# EAGLE design M236X (EAGLE 6.6.0)
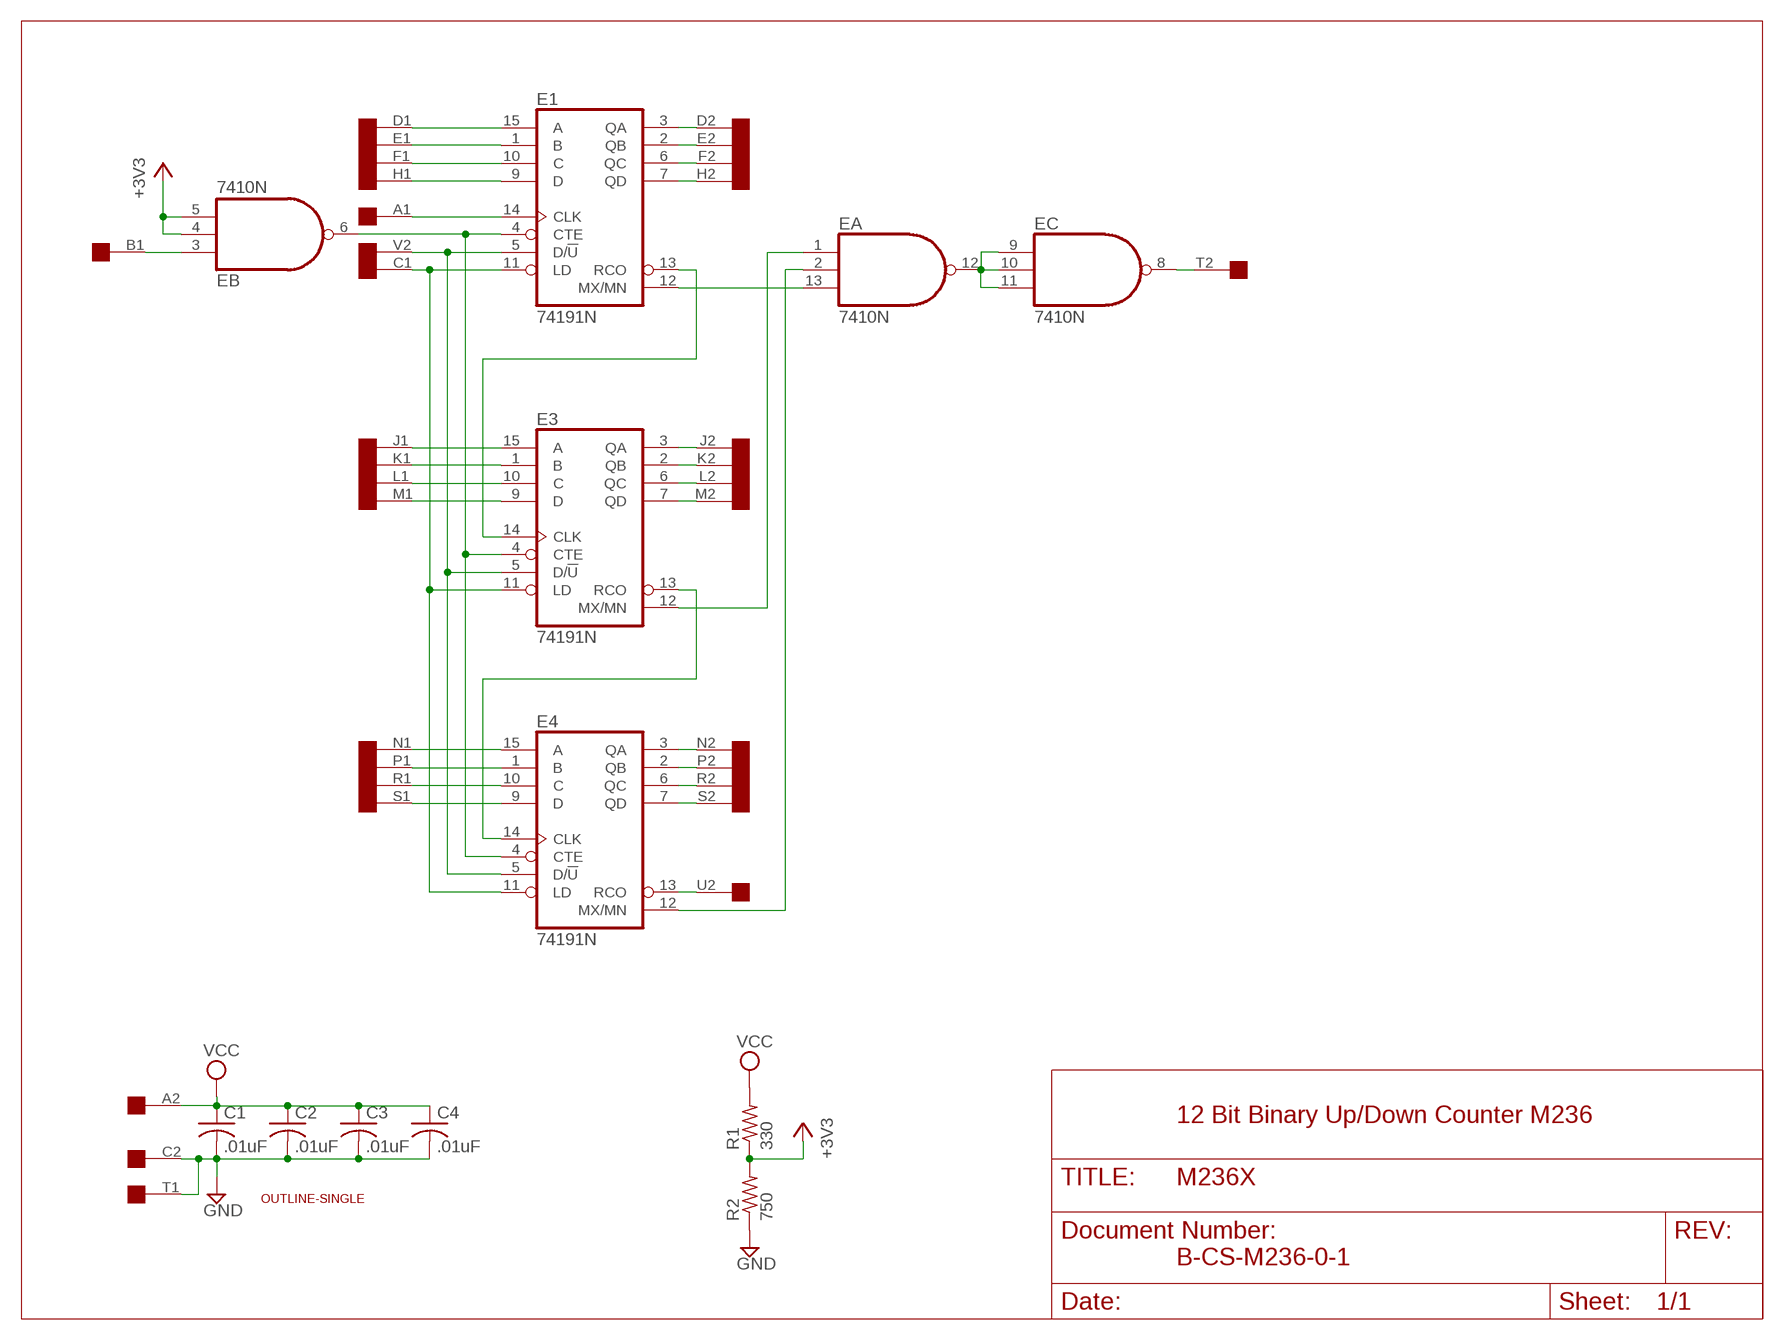
[diagram p0: schematic, sheet 1]

## Parts
C1  .01uF  C-US050-025X075  [C050-025X075]
C2  .01uF  C-US050-025X075  [C050-025X075]
C3  .01uF  C-US050-025X075  [C050-025X075]
C4  .01uF  C-US050-025X075  [C050-025X075]
E  7410N  [DIL14]
E1  74191N  [DIL16]
E3  74191N  [DIL16]
E4  74191N  [DIL16]
R1  330  R-US_0207/10  [0207/10]
R2  750  R-US_0207/10  [0207/10]
U$1  OUTLINE-SINGLE  [SINGLE]
U$2  SINGLE  [EDGE-CON2]

## Nets
+3V3: E.4(B:I1) E.5(B:I2) R1.1 R2.2
GND: C1.2 C2.2 C3.2 C4.2 R2.1 U$2.C2 U$2.T1
N$1: E1.7(QD) U$2.H2
N$2: E1.6(QC) U$2.F2
N$3: E1.2(QB) U$2.E2
N$4: E1.3(QA) U$2.D2
N$5: E1.9(D) U$2.H1
N$6: E1.10(C) U$2.F1
N$7: E1.1(B) U$2.E1
N$8: E1.15(A) U$2.D1
N$9: E3.6(QC) U$2.L2
N$10: E3.7(QD) U$2.M2
N$11: E4.3(QA) U$2.N2
N$12: E4.2(QB) U$2.P2
N$13: E4.6(QC) U$2.R2
N$14: E4.7(QD) U$2.S2
N$15: E3.2(QB) U$2.K2
N$16: E3.3(QA) U$2.J2
N$17: E4.9(D) U$2.S1
N$18: E4.10(C) U$2.R1
N$19: E4.1(B) U$2.P1
N$20: E4.15(A) U$2.N1
N$21: E3.9(D) U$2.M1
N$22: E3.10(C) U$2.L1
N$23: E3.1(B) U$2.K1
N$24: E3.15(A) U$2.J1
N$25: E1.11(LD) E3.11(LD) E4.11(LD) U$2.C1
N$26: E1.5(D/!U) E3.5(D/!U) E4.5(D/!U) U$2.V2
N$27: E4.13(RCO) U$2.U2
N$28: E.8(C:O) U$2.T2
N$29: E1.4(CTE) E3.4(CTE) E4.4(CTE) E.6(B:O)
N$30: E3.13(RCO) E4.14(CLK)
N$31: E.3(B:I0) U$2.B1
N$32: E4.12(MX/MN) E.2(A:I1)
N$33: E3.12(MX/MN) E.1(A:I0)
N$34: E.9(C:I0) E.10(C:I1) E.11(C:I2) E.12(A:O)
N$35: E1.12(MX/MN) E.13(A:I2)
N$36: E1.14(CLK) U$2.A1
N$37: E1.13(RCO) E3.14(CLK)
VCC: C1.1 C2.1 C3.1 C4.1 R1.2 U$2.A2
Unconnected: U$2.B2 U$2.U1 U$2.V1

## Notes on the sheet
- 12 Bit Binary Up/Down Counter M236
- B-CS-M236-0-1

## Power pins joined to a net without a drawn wire
GND: E1.8(GND) E3.8(GND) E4.8(GND) E.7(P:GND)
VCC: E1.16(VCC) E3.16(VCC) E4.16(VCC) E.14(P:VCC)

## Library data of the parts
C1-C4 = rcl:C-US: CAPACITOR, American symbol
E = 74xx-us:74*10: Triple 3-input NAND gate
E1 E3 E4 = 74xx-us:74*191: Synchronous UP/DOWN COUNTER
R1 R2 = rcl:R-US_: RESISTOR, American symbol
U$1 = dec-con:OUTLINE-*: Board outlines for DEC boards.
U$2 = dec-con:SINGLE: Single-Height DEC board

## Net classes
0 default: width 0.813 mm

## Board
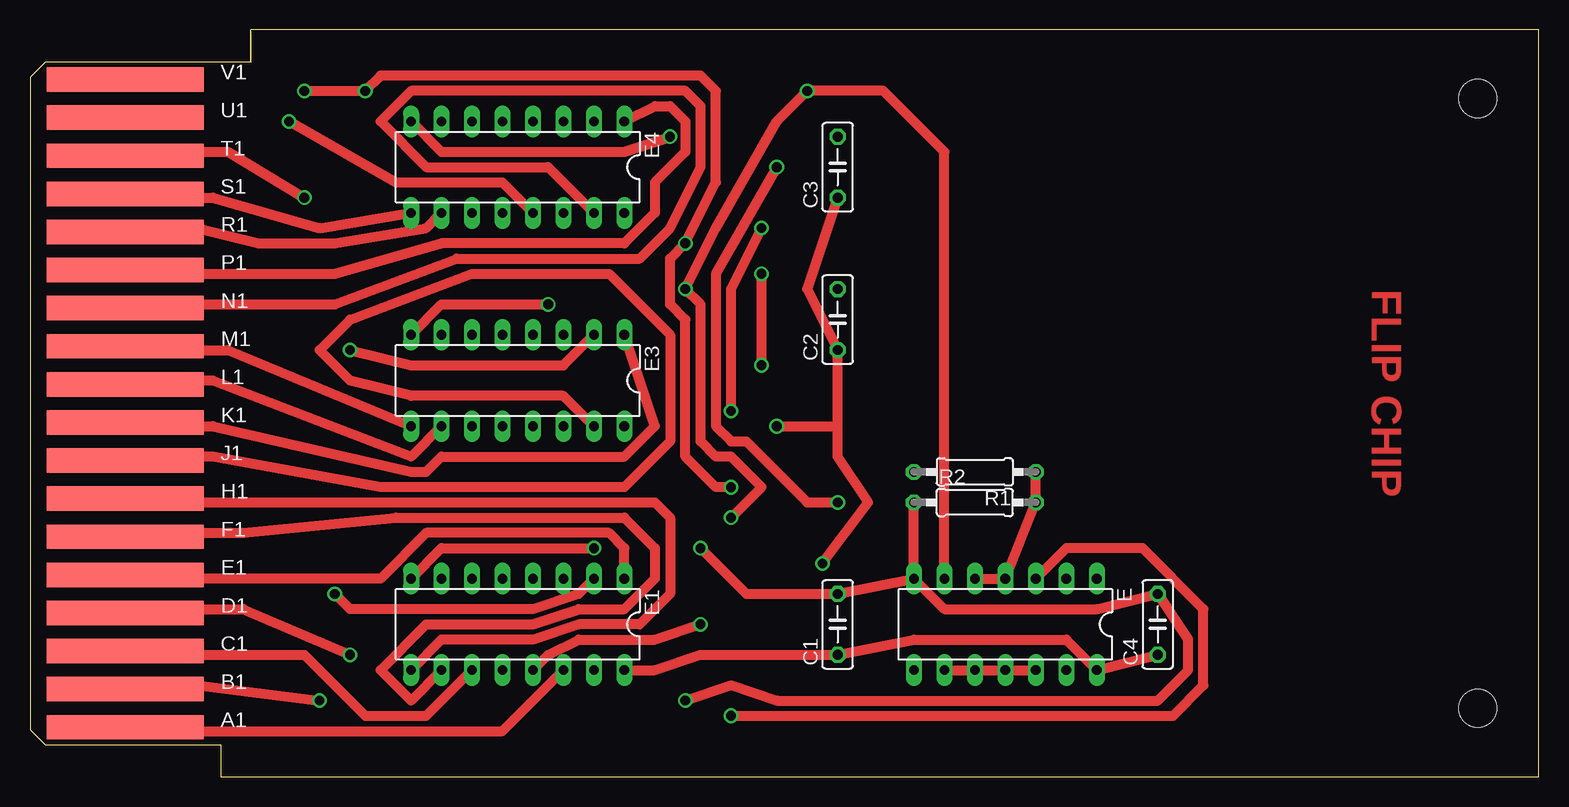
[diagram p1: board, top side]
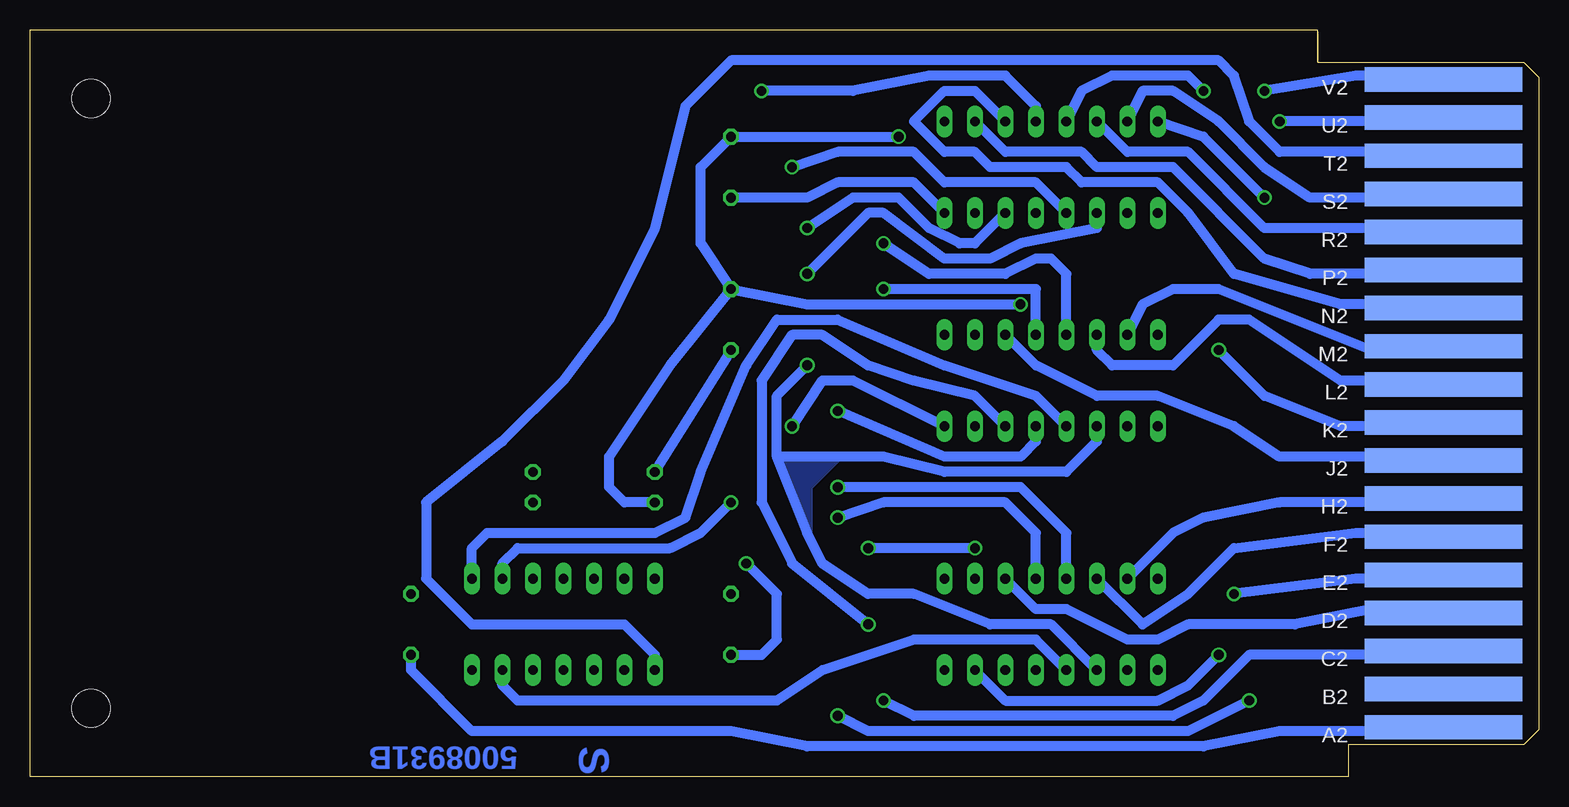
[diagram p2: board, bottom side, seen from below]

Size 125.73 x 62.23 mm. Coordinates in mm from the lower left corner, seen from the top.
Copper layers (1+16): Top 0.035mm / dielectric 1.5mm / Bottom 0.035mm
Design rules "16mils": minimum track width 16mil, minimum drill 32mil, track to track 15mil, track to pad 10mil, pad to pad 10mil, via to via 10mil, smd to smd 10mil, copper to edge 13mil, drill to drill 10mil, minimum pad ring 10mil, minimum via ring 8mil, stop-mask expansion 0mil, vias tented up to drill 0mil, thermal gap 10mil

### Footprints (pad centres in the part's own frame; a part is rotated, then mirrored left to right if it is on the bottom)
C050-025X075 = drill 0.813 octagon: 1 -2.54,0; 2 2.54,0
DIL14 = drill 0.813 long: 1 -7.62,-3.81; 2 -5.08,-3.81; 3 -2.54,-3.81; 4 0,-3.81; 5 2.54,-3.81; 6 5.08,-3.81; 7 7.62,-3.81; 8 7.62,3.81; 9 5.08,3.81; 10 2.54,3.81; 11 0,3.81; 12 -2.54,3.81; 13 -5.08,3.81; 14 -7.62,3.81
DIL16 = drill 0.813 long: 1 -8.89,-3.81; 2 -6.35,-3.81; 3 -3.81,-3.81; 4 -1.27,-3.81; 5 1.27,-3.81; 6 3.81,-3.81; 7 6.35,-3.81; 8 8.89,-3.81; 9 8.89,3.81; 10 6.35,3.81; 11 3.81,3.81; 12 1.27,3.81; 13 -1.27,3.81; 14 -3.81,3.81; 15 -6.35,3.81; 16 -8.89,3.81
0207/10 = drill 0.813 octagon: 1 -5.08,0; 2 5.08,0
SINGLE = hole 3.175: 120.65,56.515; 120.65,5.715
EDGE-CON2 = smd 13.106 x 2.032: A1 7.938,4.128; B1 7.938,7.303; C1 7.938,10.477; D1 7.938,13.652; E1 7.938,16.828; F1 7.938,20.003; H1 7.938,23.177; J1 7.938,26.352; K1 7.938,29.527; L1 7.938,32.703; M1 7.938,35.877; N1 7.938,39.053; P1 7.938,42.227; R1 7.938,45.403; S1 7.938,48.578; T1 7.938,51.752; U1 7.938,54.928; V1 7.938,58.102 | smd 13.106 x 2.032 bottom: A2 7.938,4.128; B2 7.938,7.303; C2 7.938,10.477; D2 7.938,13.652; E2 7.938,16.828; F2 7.938,20.003; H2 7.938,23.177; J2 7.938,26.352; K2 7.938,29.527; L2 7.938,32.703; M2 7.938,35.877; N2 7.938,39.053; P2 7.938,42.227; R2 7.938,45.403; S2 7.938,48.578; T2 7.938,51.752; U2 7.938,54.928; V2 7.938,58.102

### Placement (x,y rotation side)
C1  67.31,12.7 90 top
C2  67.31,38.1 90 top
C3  67.31,50.8 90 top
C4  93.98,12.7 90 top
E  81.28,12.7 180 top
E1  40.64,12.7 180 top
E3  40.64,33.02 180 top
E4  40.64,50.8 180 top
R1  78.74,25.4 180 top
R2  78.74,22.86 0 top
U$1  0,0 0 top
U$2  0,0 0 top

### Tracks (layer width: path | path; a pad name or v marks a point on that pad's centre or on a via)
+3V3
  Top 0.813: R1.1 R2.2 E.4 E.5
GND  (via drill 0.81)
  Top 0.813: E.7 R2.1 | E.7 C1.2 59.69,15.24 v55.88,19.05 | v54.61,6.35 58.42,7.62 62.23,6.35 93.98,6.35 96.52,8.89 96.52,11.43 C4.2 88.9,13.97 76.2,13.97 E.7 | E4.8 34.29,52.07 49.53,52.07 v53.34,53.34 | U$2.T1 10.16,52.07 16.51,52.07 v22.86,48.26 | E3.8 34.29,39.37 v43.18,39.37 | E1.8 34.29,19.05 v46.99,19.05
  Bottom 0.813: U$2.C2 11.43,10.16 24.13,10.16 27.94,6.35 30.48,5.08 52.07,5.08 v54.61,6.35 | v53.34,53.34 C3.2 69.85,50.8 69.85,44.45 C2.2 | R2.1 76.2,22.86 77.47,24.13 77.47,26.67 72.39,34.29 C2.2 | E4.8 27.94,53.34 v22.86,48.26 | C2.2 60.96,39.37 v43.18,39.37 | v46.99,19.05 v55.88,19.05
N$1
  Bottom 0.813: U$2.H2 10.16,22.86 21.59,22.86 27.94,21.59 30.48,20.32 E1.7
N$2
  Bottom 0.813: E1.6 33.02,12.7 29.21,15.24 25.4,19.05 15.24,20.32 8.89,20.32 U$2.F2
N$3  (via drill 0.81)
  Top 0.813: E1.2 45.72,15.24 41.91,13.97 26.67,13.97 v25.4,15.24
  Bottom 0.813: U$2.E2 8.89,16.51 15.24,16.51 v25.4,15.24
N$4
  Bottom 0.813: U$2.D2 10.16,13.97 13.97,13.97 20.32,12.7 29.21,12.7 31.75,11.43 34.29,11.43 39.37,13.97 41.91,13.97 E1.3
N$5
  Top 0.813: U$2.H1 10.16,22.86 52.07,22.86 53.34,21.59 53.34,15.24 50.8,12.7 45.72,12.7 41.91,11.43 34.29,11.43 E1.9
N$6
  Top 0.813: U$2.F1 10.16,20.32 17.78,20.32 30.48,21.59 49.53,21.59 52.07,19.05 52.07,16.51 49.53,13.97 45.72,13.97 41.91,12.7 33.02,12.7 29.21,8.89 31.75,6.35 E1.10
N$7
  Top 0.813: E1.1 49.53,19.05 48.26,20.32 33.02,20.32 29.21,16.51 8.89,16.51 U$2.E1
N$8  (via drill 0.81)
  Top 0.813: U$2.D1 8.89,13.97 17.78,13.97 v26.67,10.16
  Bottom 0.813: E1.15 44.45,6.35 31.75,6.35 29.21,7.62 v26.67,10.16
N$9
  Bottom 0.813: U$2.L2 10.16,33.02 16.51,33.02 24.13,38.1 26.67,38.1 30.48,34.29 35.56,34.29 36.83,35.56 E3.6
N$10
  Bottom 0.813: U$2.M2 8.89,35.56 13.97,35.56 26.67,40.64 30.48,40.64 33.02,39.37 E3.7
N$11
  Bottom 0.813: U$2.N2 8.89,39.37 16.51,39.37 25.4,41.91 29.21,46.99 31.75,49.53 38.1,49.53 39.37,50.8 45.72,50.8 46.99,52.07 49.53,52.07 52.07,54.61 49.53,57.15 46.99,57.15 E4.3
N$12
  Bottom 0.813: U$2.P2 10.16,41.91 19.05,41.91 22.86,43.18 30.48,50.8 36.83,50.8 38.1,52.07 44.45,52.07 E4.2
N$13
  Bottom 0.813: U$2.R2 10.16,45.72 22.86,45.72 29.21,52.07 34.29,52.07 E4.6
N$14
  Bottom 0.813: U$2.S2 10.16,48.26 19.05,48.26 22.86,50.8 26.67,54.61 30.48,57.15 33.02,57.15 E4.7
N$15  (via drill 0.81)
  Top 0.813: v26.67,35.56 31.75,34.29 44.45,34.29 E3.2
  Bottom 0.813: U$2.K2 11.43,29.21 16.51,29.21 22.86,31.75 v26.67,35.56
N$16
  Bottom 0.813: U$2.J2 10.16,26.67 21.59,26.67 25.4,29.21 31.75,31.75 36.83,31.75 41.91,34.29 E3.3
N$17
  Top 0.813: U$2.S1 10.16,48.26 15.24,48.26 24.13,45.72 E4.9
N$18
  Top 0.813: U$2.R1 10.16,45.72 13.97,45.72 19.05,44.45 25.4,44.45 33.02,45.72 E4.10
N$19
  Top 0.813: E4.1 52.07,55.88 53.34,55.88 54.61,54.61 54.61,52.07 52.07,49.53 52.07,46.99 49.53,44.45 34.29,44.45 25.4,41.91 10.16,41.91 U$2.P1
N$20
  Top 0.813: U$2.N1 11.43,39.37 25.4,39.37 35.56,43.18 50.8,43.18 53.34,45.72 55.88,50.8 55.88,55.88 54.61,57.15 31.75,57.15 29.21,54.61 33.02,50.8 43.18,50.8 E4.15
N$21
  Top 0.813: U$2.M1 8.89,35.56 16.51,35.56 E3.9
N$22
  Top 0.813: E3.10 31.75,26.67 15.24,33.02 8.89,33.02 U$2.L1
N$23
  Top 0.813: U$2.K1 8.89,29.21 15.24,29.21 31.75,25.4 33.02,25.4 34.29,26.67 49.53,26.67 52.07,29.21 E3.1
N$24
  Top 0.813: E3.15 44.45,31.75 31.75,31.75 26.67,33.02 24.13,35.56 26.67,38.1 36.83,41.91 48.26,41.91 53.34,36.83 53.34,27.94 49.53,24.13 29.21,24.13 15.24,26.67 8.89,26.67 U$2.J1
N$25  (via drill 0.81)
  Top 0.813: v60.96,34.29 v60.96,41.91 | U$2.C1 8.89,10.16 22.86,10.16 27.94,5.08 33.02,5.08 E1.11
  Bottom 0.813: E1.11 40.64,12.7 45.72,12.7 52.07,15.24 55.88,15.24 59.69,17.78 60.96,20.32 63.5,26.67 | 63.5,26.67 63.5,31.75 v60.96,34.29 | E3.11 36.83,27.94 39.37,25.4 49.53,25.4 54.61,26.67 63.5,26.67 | E4.11 36.83,45.72 43.18,44.45 45.72,43.18 49.53,43.18 54.61,46.99 55.88,46.99 v60.96,41.91
  pour Bottom: 58.42,26.67 60.96,24.13 60.96,20.32 63.5,26.67
N$26  (via drill 0.81)
  Top 0.813: v22.86,57.15 v27.94,57.15 29.21,58.42 55.88,58.42 57.15,57.15 57.15,49.53 v54.61,44.45 53.34,43.18 53.34,39.37 54.61,38.1 54.61,26.67 57.15,24.13 v58.42,24.13
  Bottom 0.813: U$2.V2 10.16,58.42 15.24,58.42 v22.86,57.15 | v27.94,57.15 29.21,58.42 35.56,58.42 38.1,57.15 E4.5 | E1.5 39.37,20.32 43.18,24.13 v58.42,24.13 | E3.5 39.37,41.91 40.64,43.18 41.91,43.18 44.45,41.91 50.8,41.91 v54.61,44.45
N$27  (via drill 0.81)
  Top 0.813: v21.59,54.61 30.48,49.53 39.37,49.53 E4.13
  Bottom 0.813: U$2.U2 10.16,54.61 v21.59,54.61
N$28
  Bottom 0.813: U$2.T2 10.16,52.07 21.59,52.07 24.13,54.61 25.4,58.42 26.67,59.69 67.31,59.69 71.12,55.88 73.66,45.72 77.47,38.1 81.28,33.02 86.36,27.94 92.71,22.86 92.71,16.51 88.9,12.7 76.2,12.7 73.66,10.16 E.8
N$29  (via drill 0.81)
  Top 0.813: v58.42,21.59 60.96,24.13 58.42,26.67 57.15,26.67 55.88,27.94 55.88,39.37 v54.61,40.64 57.15,45.72 62.23,54.61 v64.77,57.15 71.12,57.15 76.2,52.07 E.6
  Bottom 0.813: E1.4 41.91,20.32 44.45,22.86 54.61,22.86 v58.42,21.59 | E3.4 41.91,40.64 v54.61,40.64 | E4.4 41.91,55.88 44.45,58.42 50.8,58.42 57.15,57.15 v64.77,57.15
N$30  (via drill 0.81)
  Top 0.813: v58.42,30.48 58.42,40.64 v60.96,45.72
  Bottom 0.813: E4.14 46.99,44.45 48.26,44.45 50.8,45.72 53.34,48.26 57.15,48.26 v60.96,45.72 | E3.13 41.91,27.94 43.18,26.67 49.53,26.67 v58.42,30.48
N$31  (via drill 0.81)
  Top 0.813: U$2.B1 10.16,7.62 13.97,7.62 v24.13,6.35 | v58.42,5.08 95.25,5.08 97.79,7.62 97.79,13.97 92.71,19.05 86.36,19.05 E.3
  Bottom 0.813: v24.13,6.35 29.21,3.81 55.88,3.81 v58.42,5.08
N$32  (via drill 0.81)
  Top 0.813: v62.23,50.8 57.15,41.91 57.15,29.21 58.42,27.94 59.69,27.94 64.77,22.86 v67.31,22.86
  Bottom 0.813: E.2 86.36,17.78 85.09,19.05 72.39,19.05 69.85,20.32 v67.31,22.86 | E4.12 41.91,49.53 49.53,49.53 52.07,52.07 58.42,52.07 v62.23,50.8
N$33
  Bottom 0.813: E.1 88.9,19.05 87.63,20.32 73.66,20.32 71.12,21.59 69.85,25.4 66.04,34.29 63.5,38.1 58.42,38.1 49.53,34.29 41.91,31.75 E3.12
N$34
  Top 0.813: E.9 E.10 E.11 E.12
N$35
  Bottom 0.813: E1.12 41.91,11.43 52.07,11.43 59.69,8.89 63.5,6.35 85.09,6.35 86.36,7.62 E.13
N$36
  Top 0.813: U$2.A1 10.16,3.81 39.37,3.81 E1.14
N$37  (via drill 0.81)
  Top 0.813: E1.13 43.18,10.16 45.72,11.43 52.07,11.43 v55.88,12.7
  Bottom 0.813: E3.14 46.99,31.75 52.07,33.02 55.88,34.29 59.69,36.83 62.23,36.83 64.77,33.02 64.77,22.86 62.23,17.78 v55.88,12.7
VCC  (via drill 0.81)
  Top 0.813: C4.1 E.14 86.36,11.43 73.66,11.43 C1.1 55.88,10.16 52.07,8.89 E1.16 | C3.1 64.77,40.64 C2.1 67.31,29.21 | v66.04,17.78 69.85,22.86 67.31,26.67 67.31,29.21 | v62.23,29.21 67.31,29.21
  Bottom 0.813: U$2.A2 11.43,4.13 11.43,3.81 21.59,3.81 27.94,2.54 60.96,2.54 67.31,3.81 88.9,3.81 93.98,8.89 C4.1 | E4.16 52.07,49.53 58.42,49.53 60.96,48.26 C3.1 | R1.2 C2.1 | C1.1 64.77,10.16 63.5,11.43 63.5,15.24 v66.04,17.78 | E3.16 57.15,33.02 59.69,33.02 v62.23,29.21

### Text on the board
Top: FLIP CHIP
Bottom: S | 5008931B